# EasyEDA Pro project G07_太阳能景观灯_PCB终稿_2024-07-05.epro

# Schematic Schematic1
Create Date: 2024-07-01; Page Name: P1; Project Name: G07_太阳能景观灯; Schematic Name: Schematic1; Update Date: 2024-07-04; Company: ZJU; Page Size: A4; Version: V1.0
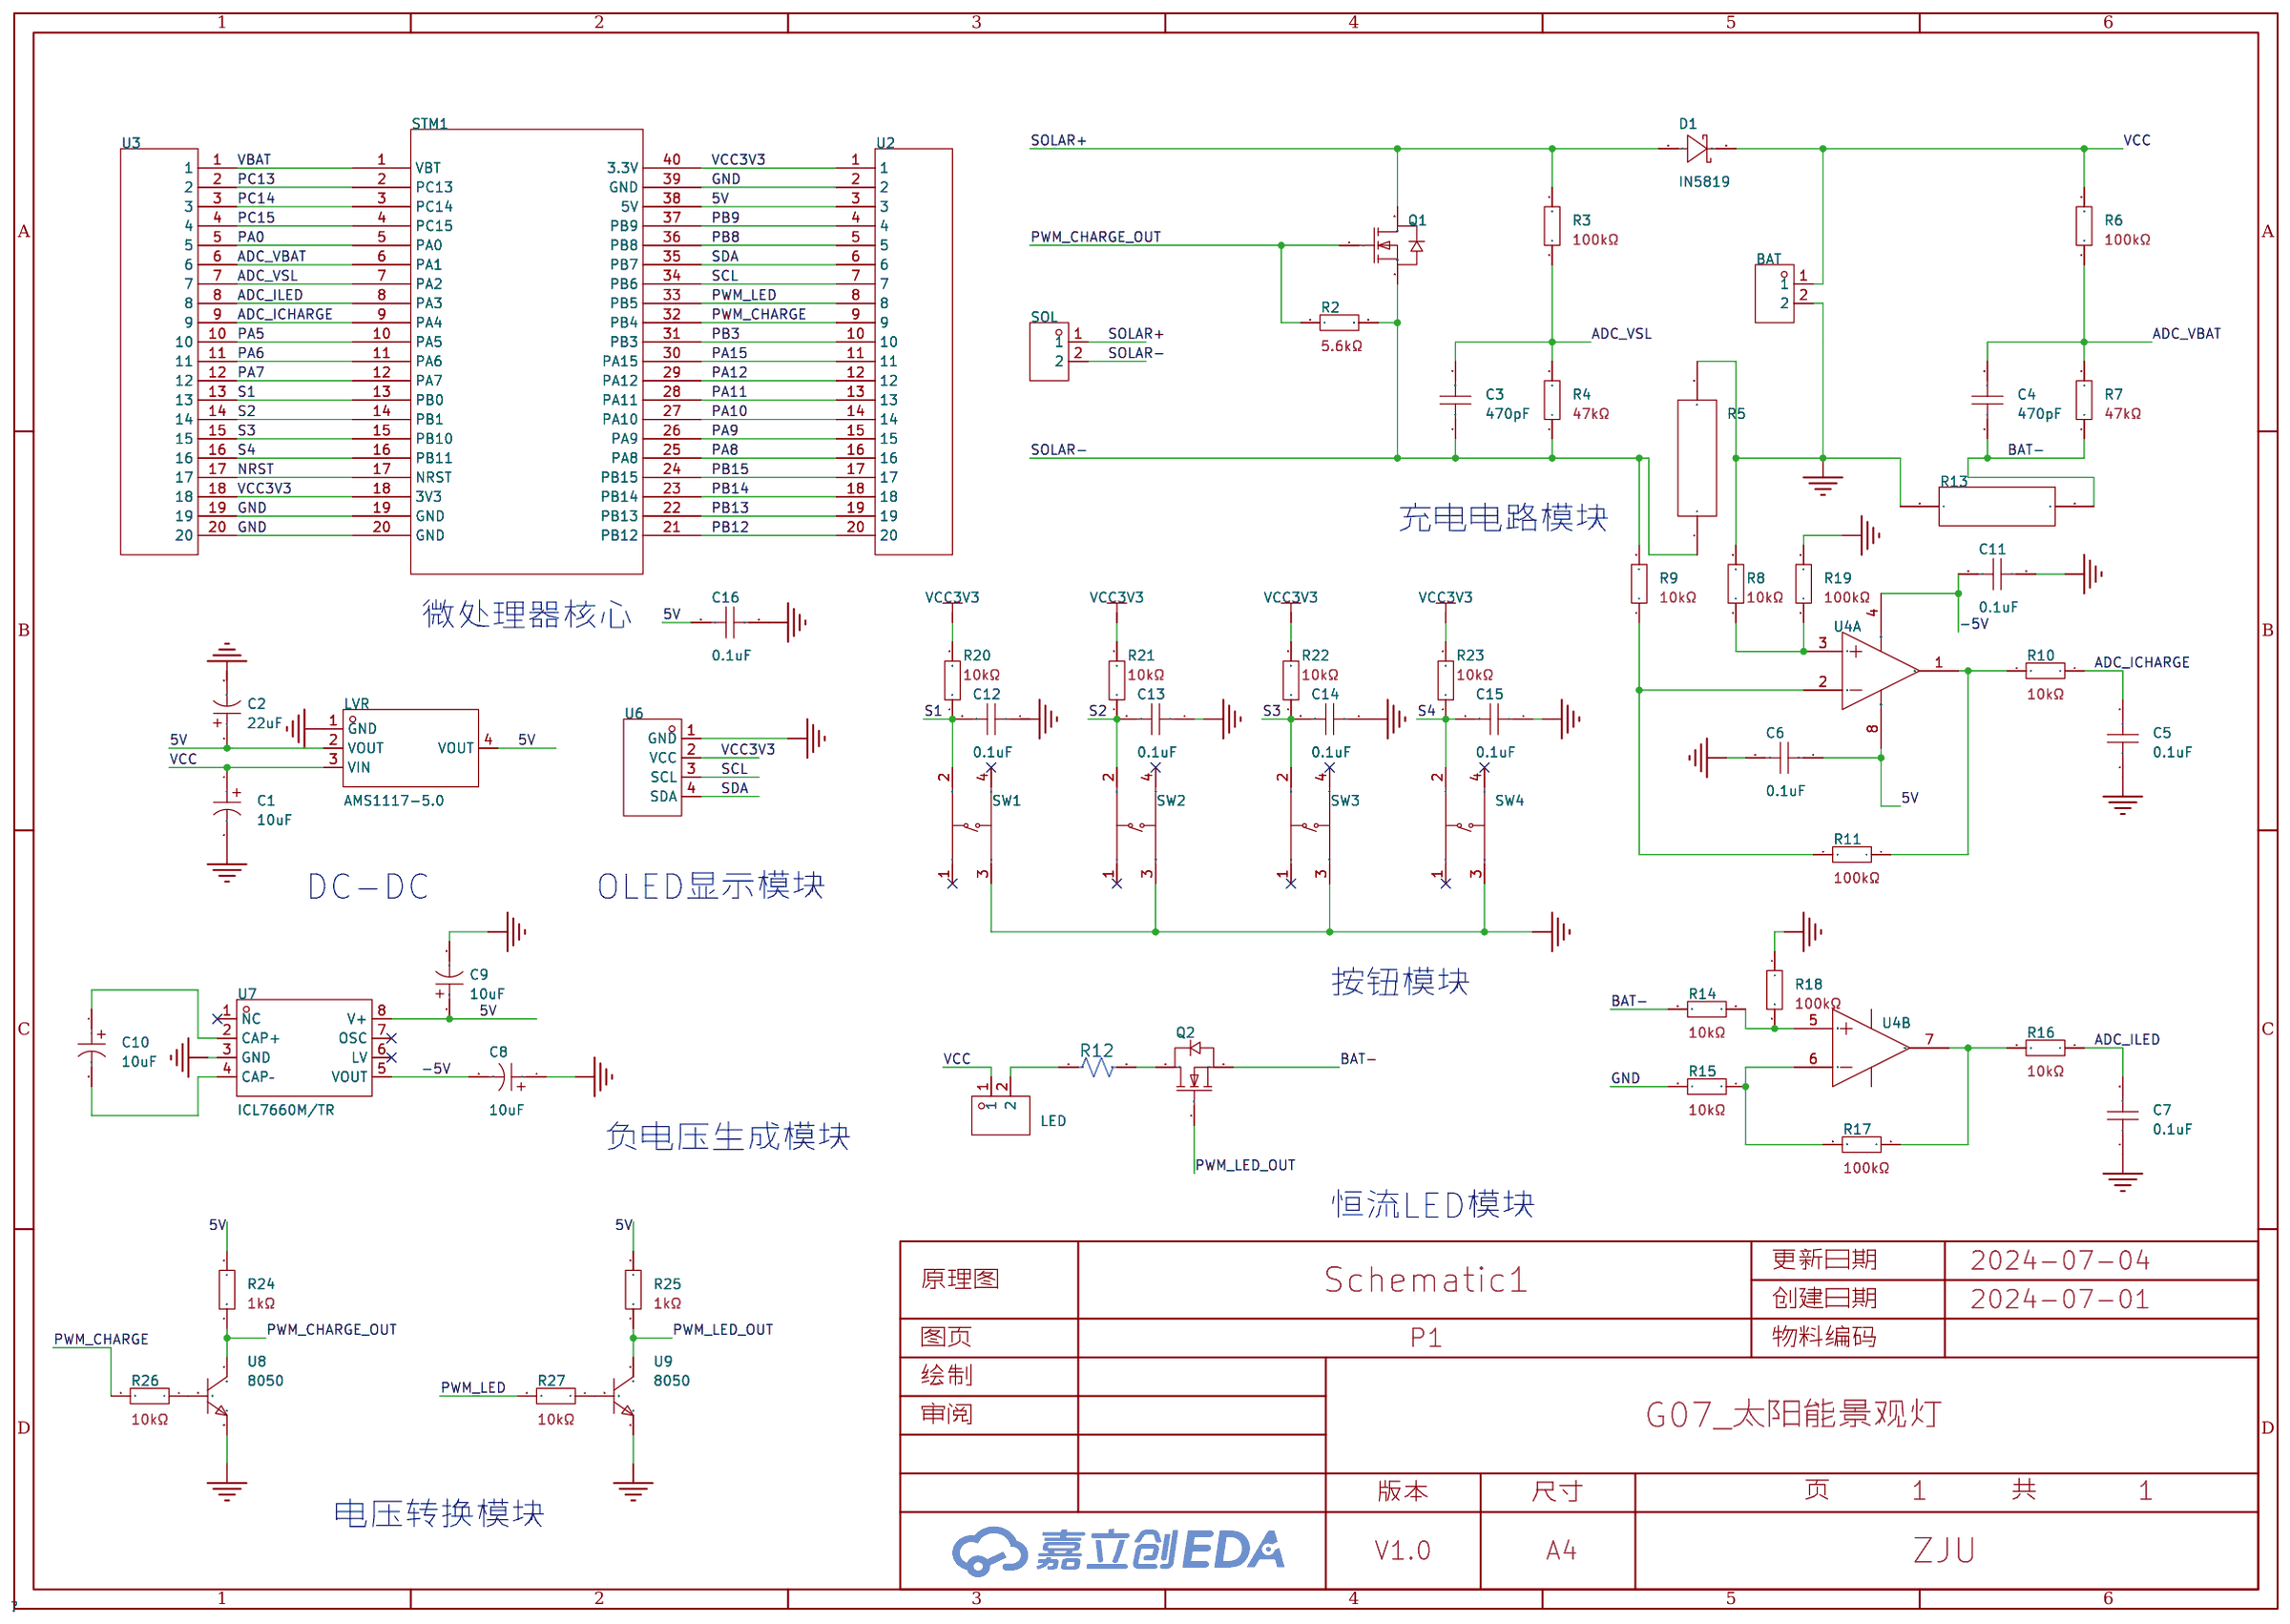
[diagram p0: schematic sheet]

## Parts
BAT  KF2EDGK-5.08-2P  [CONN-TH_2P-P5.08_DB2EVC-5.08-2P-BK]
C1  10uF  [C0511_直插电解]
C2  22uF  [C0511_直插电解]
C3  470pF  [CC1H104ZA1FD3F6C1000]
C4  470pF  [CC1H104ZA1FD3F6C1000]
C5  0.1uF  [CC1H104ZA1FD3F6C1000]
C6  0.1uF  [CC1H104ZA1FD3F6C1000]
C7  0.1uF  [CC1H104ZA1FD3F6C1000]
C8  10uF  [C0511_直插电解]
C9  10uF  [C0511_直插电解]
C10  10uF  [C0511_直插电解]
C11  0.1uF  [CC1H104ZA1FD3F6C1000]
C12  0.1uF  [CC1H104ZA1FD3F6C1000]
C13  0.1uF  [CC1H104ZA1FD3F6C1000]
C14  0.1uF  [CC1H104ZA1FD3F6C1000]
C15  0.1uF  [CC1H104ZA1FD3F6C1000]
C16  0.1uF  [CC1H104ZA1FD3F6C1000]
D1  IN5819  [DO-41_BD2.4-L4.7-P8.70-D0.8-FD]
LED  KF2EDGK-5.08-2P  [CONN-TH_2P-P5.08_DB2EVC-5.08-2P-BK]
LVR  AMS1117-5.0  [SOT-223_L6.5-W3.5-P2.30-LS7.0-BR]
Q1  STP75NF75  [TO-220-3_L10.0-W4.5-P2.54-L]
Q2  STP75NF75  [TO-220-3_L10.0-W4.5-P2.54-L]
R2  AXIAL-0.4  [RES-TH_BD2.7-L8.8-P12.80-D0.5]
R3  AXIAL-0.4  [RES-TH_BD2.7-L8.8-P12.80-D0.5]
R4  AXIAL-0.4  [RES-TH_BD2.7-L8.8-P12.80-D0.5]
R5  -  [采样电阻2*10mm]
R6  AXIAL-0.4  [RES-TH_BD2.7-L8.8-P12.80-D0.5]
R7  AXIAL-0.4  [RES-TH_BD2.7-L8.8-P12.80-D0.5]
R8  AXIAL-0.4  [RES-TH_BD2.7-L8.8-P12.80-D0.5]
R9  AXIAL-0.4  [RES-TH_BD2.7-L8.8-P12.80-D0.5]
R10  AXIAL-0.4  [RES-TH_BD2.7-L8.8-P12.80-D0.5]
R11  AXIAL-0.4  [RES-TH_BD2.7-L8.8-P12.80-D0.5]
R12  -  [AXIAL_0.6]
R13  -  [采样电阻2*10mm]
R14  AXIAL-0.4  [RES-TH_BD2.7-L8.8-P12.80-D0.5]
R15  AXIAL-0.4  [RES-TH_BD2.7-L8.8-P12.80-D0.5]
R16  AXIAL-0.4  [RES-TH_BD2.7-L8.8-P12.80-D0.5]
R17  AXIAL-0.4  [RES-TH_BD2.7-L8.8-P12.80-D0.5]
R18  AXIAL-0.4  [RES-TH_BD2.7-L8.8-P12.80-D0.5]
R19  AXIAL-0.4  [RES-TH_BD2.7-L8.8-P12.80-D0.5]
R20  AXIAL-0.4  [RES-TH_BD2.7-L8.8-P12.80-D0.5]
R21  AXIAL-0.4  [RES-TH_BD2.7-L8.8-P12.80-D0.5]
R22  AXIAL-0.4  [RES-TH_BD2.7-L8.8-P12.80-D0.5]
R23  AXIAL-0.4  [RES-TH_BD2.7-L8.8-P12.80-D0.5]
R24  AXIAL-0.4  [RES-TH_BD2.7-L8.8-P12.80-D0.5]
R25  AXIAL-0.4  [RES-TH_BD2.7-L8.8-P12.80-D0.5]
R26  AXIAL-0.4  [RES-TH_BD2.7-L8.8-P12.80-D0.5]
R27  AXIAL-0.4  [RES-TH_BD2.7-L8.8-P12.80-D0.5]
SOL  KF2EDGK-5.08-2P  [CONN-TH_2P-P5.08_DB2EVC-5.08-2P-BK]
STM1  STM32103C8T6  [STM32_C8T6_核心板]
SW1  TS665CJ  [SW-TH_4P-L6.0-W6.0-P4.50-LS6.5]
SW2  TS665CJ  [SW-TH_4P-L6.0-W6.0-P4.50-LS6.5]
SW3  TS665CJ  [SW-TH_4P-L6.0-W6.0-P4.50-LS6.5]
SW4  TS665CJ  [SW-TH_4P-L6.0-W6.0-P4.50-LS6.5]
U2  -  [XH2.54_20P]
U3  -  [XH2.54_20P]
U4  LM358S  [SOP-8_L4.9-W3.9-P1.27-LS6.0-BL]  (sections 1,2)
U6  HS96L03W2C03  [OLED-TH_L27.8-W27.2-P2.54_C9900033791]
U7  ICL7660M/TR  [SOP-8_L4.9-W3.9-P1.27-LS6.0-BL]
U8  8050  [TO-92-3_L4.8-W3.7-P2.54-R]
U9  8050  [TO-92-3_L4.8-W3.7-P2.54-R]

## Library data of the parts
BAT LED SOL = KF2EDGK-5.08-2P: Supplier Part: C9900089420; Supplier Footprint: CONN-TH_2P-P5.08_DB2EVC-5.08-2P; JLCPCB Part Class: 扩展库; Supplier: LCSC
C1 C2 C8-C10 = C0511_直插电解电容: C0511直插电解电容; Supplier Footprint: 直插,D5xL11mm; Rated Voltage: 35V; φD: 5mm; L: 11mm; Lead Spacing: 2mm
C3-C7 C11-C16 = CC1H104ZA1ED3F5O1100: 容值:100nF;精度:-20%~+80%;额定电压:50V;温度系数:Y5V;; LCSC Part Name: 100nF -20%~+80% 50V; Supplier Part: C2761728; Manufacturer: Dersonic(德尔创); Supplier Footprint: 插件,P=2.54mm; JLCPCB Part Class: 扩展库; Datasheet: https://atta.szlcsc.com/upload/public/pdf/source/20211025/1A7587EB9213FE403B9063878B9D301B.pdf; Supplier: LCSC; Tolerance: -20%~+80%; Voltage Rated: 50V; Lead Spacing: 2.54mm; Temperature Coefficient: Y5V; φD: 5.8mm; Body Thickness: 2.6mm
D1 = IN5819: Supplier Part: C9900005587; Supplier Footprint: DO-41; JLCPCB Part Class: 扩展库; Supplier: LCSC
LVR = AMS1117-5.0_C6187: 输出类型:固定;最大输入电压:12V;输出电压:5V;最大输出电流:1A;电源纹波抑制比(PSRR):68dB@(120Hz);输出极性:正极;; LCSC Part Name: 输入12V 输出5V 1A; Supplier Part: C6187; Manufacturer: AMS; Supplier Footprint: SOT-223; JLCPCB Part Class: 基础库; Datasheet: https://atta.szlcsc.com/upload/public/pdf/source/20230918/E4B716057EE82179D88E8A0894830D59.pdf; Supplier: LCSC; Output Type: 固定; Maximum Input Voltage: 12V; Output Voltage: 5V; MAX Output Current: 1A; Power Supply Rejection Ratio (PSRR): 68dB@(120Hz); Dropout Voltage: 1.3V@(1A); Output Polarity: 正极; Number of Outputs: 1
Q1 Q2 = STP75NF75: 类型:N沟道;漏源电压(Vdss):75V;连续漏极电流(Id):80A;功率(Pd):300W;导通电阻(RDS(on)@Vgs,Id):11mΩ@10V,40A;阈值电压(Vgs(th)@Id):4V@250uA;; LCSC Part Name: N沟道 耐压:75V 电流:80A; Supplier Part: C13678; Manufacturer: ST(意法半导体); Supplier Footprint: TO-220; JLCPCB Part Class: 扩展库; Datasheet: https://atta.szlcsc.com/upload/public/pdf/source/20130607/1457706608687.pdf; Supplier: LCSC; Type: N沟道; Drain Source Voltage (Vdss): 75V; Continuous Drain Current (Id): 80A; Power Dissipation (Pd): 300W; Drain Source On Resistance (RDS(on)@Vgs,Id): 11mΩ@10V,40A; Gate Threshold Voltage (Vgs(th)@Id): 4V@250uA; Total Gate Charge (Qg@Vgs): 160nC@10V; Input Capacitance (Ciss@Vds): 3.7nF@25V; Operating Temperature: -55℃~+175℃@(Tj)
R2 = AXIAL-0.4: Supplier Part: C9900024059; Supplier Footprint: AXIAL; JLCPCB Part Class: 扩展库; Supplier: LCSC; Resistance: 5.6kΩ
R3 R6 R11 R17-R19 = AXIAL-0.4: Supplier Part: C9900024059; Supplier Footprint: AXIAL; JLCPCB Part Class: 扩展库; Supplier: LCSC; Resistance: 100kΩ
R4 R7 = AXIAL-0.4: Supplier Part: C9900024059; Supplier Footprint: AXIAL; JLCPCB Part Class: 扩展库; Supplier: LCSC; Resistance: 47kΩ
R5 R13 = 采样电阻
R8-R10 R14-R16 R20-R23 R26 R27 = AXIAL-0.4: Supplier Part: C9900024059; Supplier Footprint: AXIAL; JLCPCB Part Class: 扩展库; Supplier: LCSC; Resistance: 10kΩ
R12 = AXIAL0.6
R24 R25 = AXIAL-0.4: Supplier Part: C9900024059; Supplier Footprint: AXIAL; JLCPCB Part Class: 扩展库; Supplier: LCSC; Resistance: 1kΩ
STM1 = stm32103c8t6_核心板: Origin Footprint 2: DIP40
SW1-SW4 = TS665CJ: 电路结构:单刀单掷;按钮形状:圆形按钮;安装方式:直插;开关长度:6mm;开关宽度:6mm;开关高度:5mm;触点电流:50mA;额定电压(DC):12V;带灯:-;机械寿命:-;; LCSC Part Name: 6*6*5mm 直插 轻触开关; Supplier Part: C393938; Manufacturer: SHOU HAN(首韩); Supplier Footprint: 插件; JLCPCB Part Class: 扩展库; Datasheet: https://atta.szlcsc.com/upload/public/pdf/source/20190521/C393938_BDABEAC600B4C55E200A80AA129B70BC.pdf; Supplier: LCSC; Circuit: 单刀单掷; Actuator Style: 圆形按钮; Mounting Style: 直插; Switch Length: 6mm; Switch Width: 6mm; Switch Height: 5mm; Contact Current: 50mA; Voltage Rating (DC): 12V
U2 U3 = XH2.54_20P
U4 = LM358S_C408270: 放大器数:-;增益带宽积(GBP):1MHz;压摆率(SR):0.3V/us;; Supplier Part: C408270; Manufacturer: Slkor(萨科微); Supplier Footprint: SOP-8; JLCPCB Part Class: 扩展库; Datasheet: https://atta.szlcsc.com/upload/public/pdf/source/20190729/C408270_8A571363543B0DAC89A7C1628AEF28C4.pdf; Supplier: LCSC; Gain Bandwidth Product(GBP): 1MHz; Common Mode Rejection Ratio (CMRR): 80dB; Slew Rate(SR): 0.3V/us
U6 = HS96L03W2C03: 主控芯片:SSD1315;接口类型:I2C;尺寸(inch):0.96;像素分辨率:128x64;; LCSC Part Name: 0.96寸OLED显示屏窄白光IIC; Supplier Part: C5248080; Manufacturer: HS(汉昇); JLCPCB Part Class: 扩展库; Datasheet: https://atta.szlcsc.com/upload/public/pdf/source/20230627/763D01F79A90007632F098068C7C8AD9.pdf; Supplier: LCSC; Main Control Chip: SSD1315; Interface Type: I2C; Size: 0.96; Pixel Resolution: 128x64; Operating Temperature: -40℃~+70℃
U7 = ICL7660M/TR: Supplier Part: C356724; Manufacturer: HGSEMI(华冠); Supplier Footprint: SOP-8; JLCPCB Part Class: 扩展库; Datasheet: https://atta.szlcsc.com/upload/public/pdf/source/20220223/B7DC69E53F1DD57A8AF8717E7604F527.pdf; Supplier: LCSC
U8 U9 = 8050: Supplier Part: C3037602; Manufacturer: BLUE ROCKET(蓝箭); Supplier Footprint: TO-92-2.54mm; JLCPCB Part Class: 扩展库; Supplier: LCSC

## Nets
5V: C2.1 C6.1 C9.1 C16.2 LVR.2(VOUT) LVR.4(VOUT) R24.2 R25.2 STM1.38(5V) U2.3 U4.8(VCC) U7.8(V+)
-5V: C8.2 C11.2 U4.4(GND) U7.5(VOUT)
GND: BAT.2 C1.2 C2.2 C5.1 C6.2 C7.1 C8.1 C9.2 C11.1 C12.1 C13.1 C14.1 C15.1 C16.1 LVR.1(GND) R5.2 R8.2 R13.1 R15.2 R18.1 R19.2 STM1.19(GND) STM1.20(GND) STM1.39(GND) SW1.3(C) SW2.3(C) SW3.3(C) SW4.3(C) U2.2 U3.19 U3.20 U6.1(GND) U7.3(GND) U8.3(E) U9.3(E)
VBAT: STM1.1(VBT) U3.1
VCC: BAT.1 C1.1 D1.2(K) LED.1 LVR.3(VIN) R6.2
VCC3V3: R20.2 R21.2 R22.2 R23.2 STM1.18(3V3) STM1.40(3.3V) U2.1 U3.18 U6.2(VCC)
ADC_ICHARGE: C5.2 R10.1 STM1.9(PA4) U3.9
ADC_ILED: C7.2 R16.1 STM1.8(PA3) U3.8
ADC_VBAT: C4.2 R6.1 R7.2 STM1.6(PA1) U3.6
ADC_VSL: C3.2 R3.1 R4.2 STM1.7(PA2) U3.7
BAT-: C4.1 Q2.3(S) R7.1 R13.2 R14.2
NRST: STM1.17(NRST) U3.17
PA0: STM1.5(PA0) U3.5
PA5: STM1.10(PA5) U3.10
PA6: STM1.11(PA6) U3.11
PA7: STM1.12(PA7) U3.12
PA8: STM1.25(PA8) U2.16
PA9: STM1.26(PA9) U2.15
PA10: STM1.27(PA10) U2.14
PA11: STM1.28(PA11) U2.13
PA12: STM1.29(PA12) U2.12
PA15: STM1.30(PA15) U2.11
PB3: STM1.31(PB3) U2.10
PB8: STM1.36(PB8) U2.5
PB9: STM1.37(PB9) U2.4
PB12: STM1.21(PB12) U2.20
PB13: STM1.22(PB13) U2.19
PB14: STM1.23(PB14) U2.18
PB15: STM1.24(PB15) U2.17
PC13: STM1.2(PC13) U3.2
PC14: STM1.3(PC14) U3.3
PC15: STM1.4(PC15) U3.4
PWM_CHARGE: R26.2 STM1.32(PB4) U2.9
PWM_CHARGE_OUT: Q1.1(G) R2.1 R24.1 U8.1(C)
PWM_LED: R27.2 STM1.33(PB5) U2.8
PWM_LED_OUT: Q2.1(G) R25.1 U9.1(C)
S1: C12.2 R20.1 STM1.13(PB0) SW1.2(B) U3.13
S2: C13.2 R21.1 STM1.14(PB1) SW2.2(B) U3.14
S3: C14.2 R22.1 STM1.15(PB10) SW3.2(B) U3.15
S4: C15.2 R23.1 STM1.16(PB11) SW4.2(B) U3.16
SCL: STM1.34(PB6) U2.7 U6.3(SCL)
SDA: STM1.35(PB7) U2.6 U6.4(SDA)
SOLAR+: D1.1(A) Q1.2(D) R3.2 SOL.1
SOLAR-: C3.1 Q1.3(S) R2.2 R4.1 R5.1 R9.2 SOL.2
$1N3294: R10.2 R11.1 U4.1(OUT1)
$1N3303: R9.1 R11.2 U4.2(IN1-)
$1N14439: R14.1 R18.2 U4.5(IN2+)
$1N14610: R16.2 R17.1 U4.7(OUT2)
$1N14619: R15.1 R17.2 U4.6(IN2-)
$1N14806: R8.1 R19.1 U4.3(IN1+)
$1N19814: C10.2 U7.4(CAP–)
$1N19908: C10.1 U7.2(CAP+)
$1N30770: LED.2 R12.1
$1N30774: Q2.2(D) R12.2
$1N32429: R26.1 U8.2(B)
$1N32462: R27.1 U9.2(B)

Not connected (* = marked no-connect by the designer): SW1 1(A)* 4(D)*; SW2 1(A)* 4(D)*; SW3 1(A)* 4(D)*; SW4 1(A)* 4(D)*; U7 1(NC)* 6(LV)* 7(OSC)*

## Notes on the sheet
- 充电电路模块
- 微处理器核心
- DC-DC
- OLED显示模块
- 按钮模块
- 负电压生成模块
- 恒流LED模块
- 电压转换模块

# Board PCB1
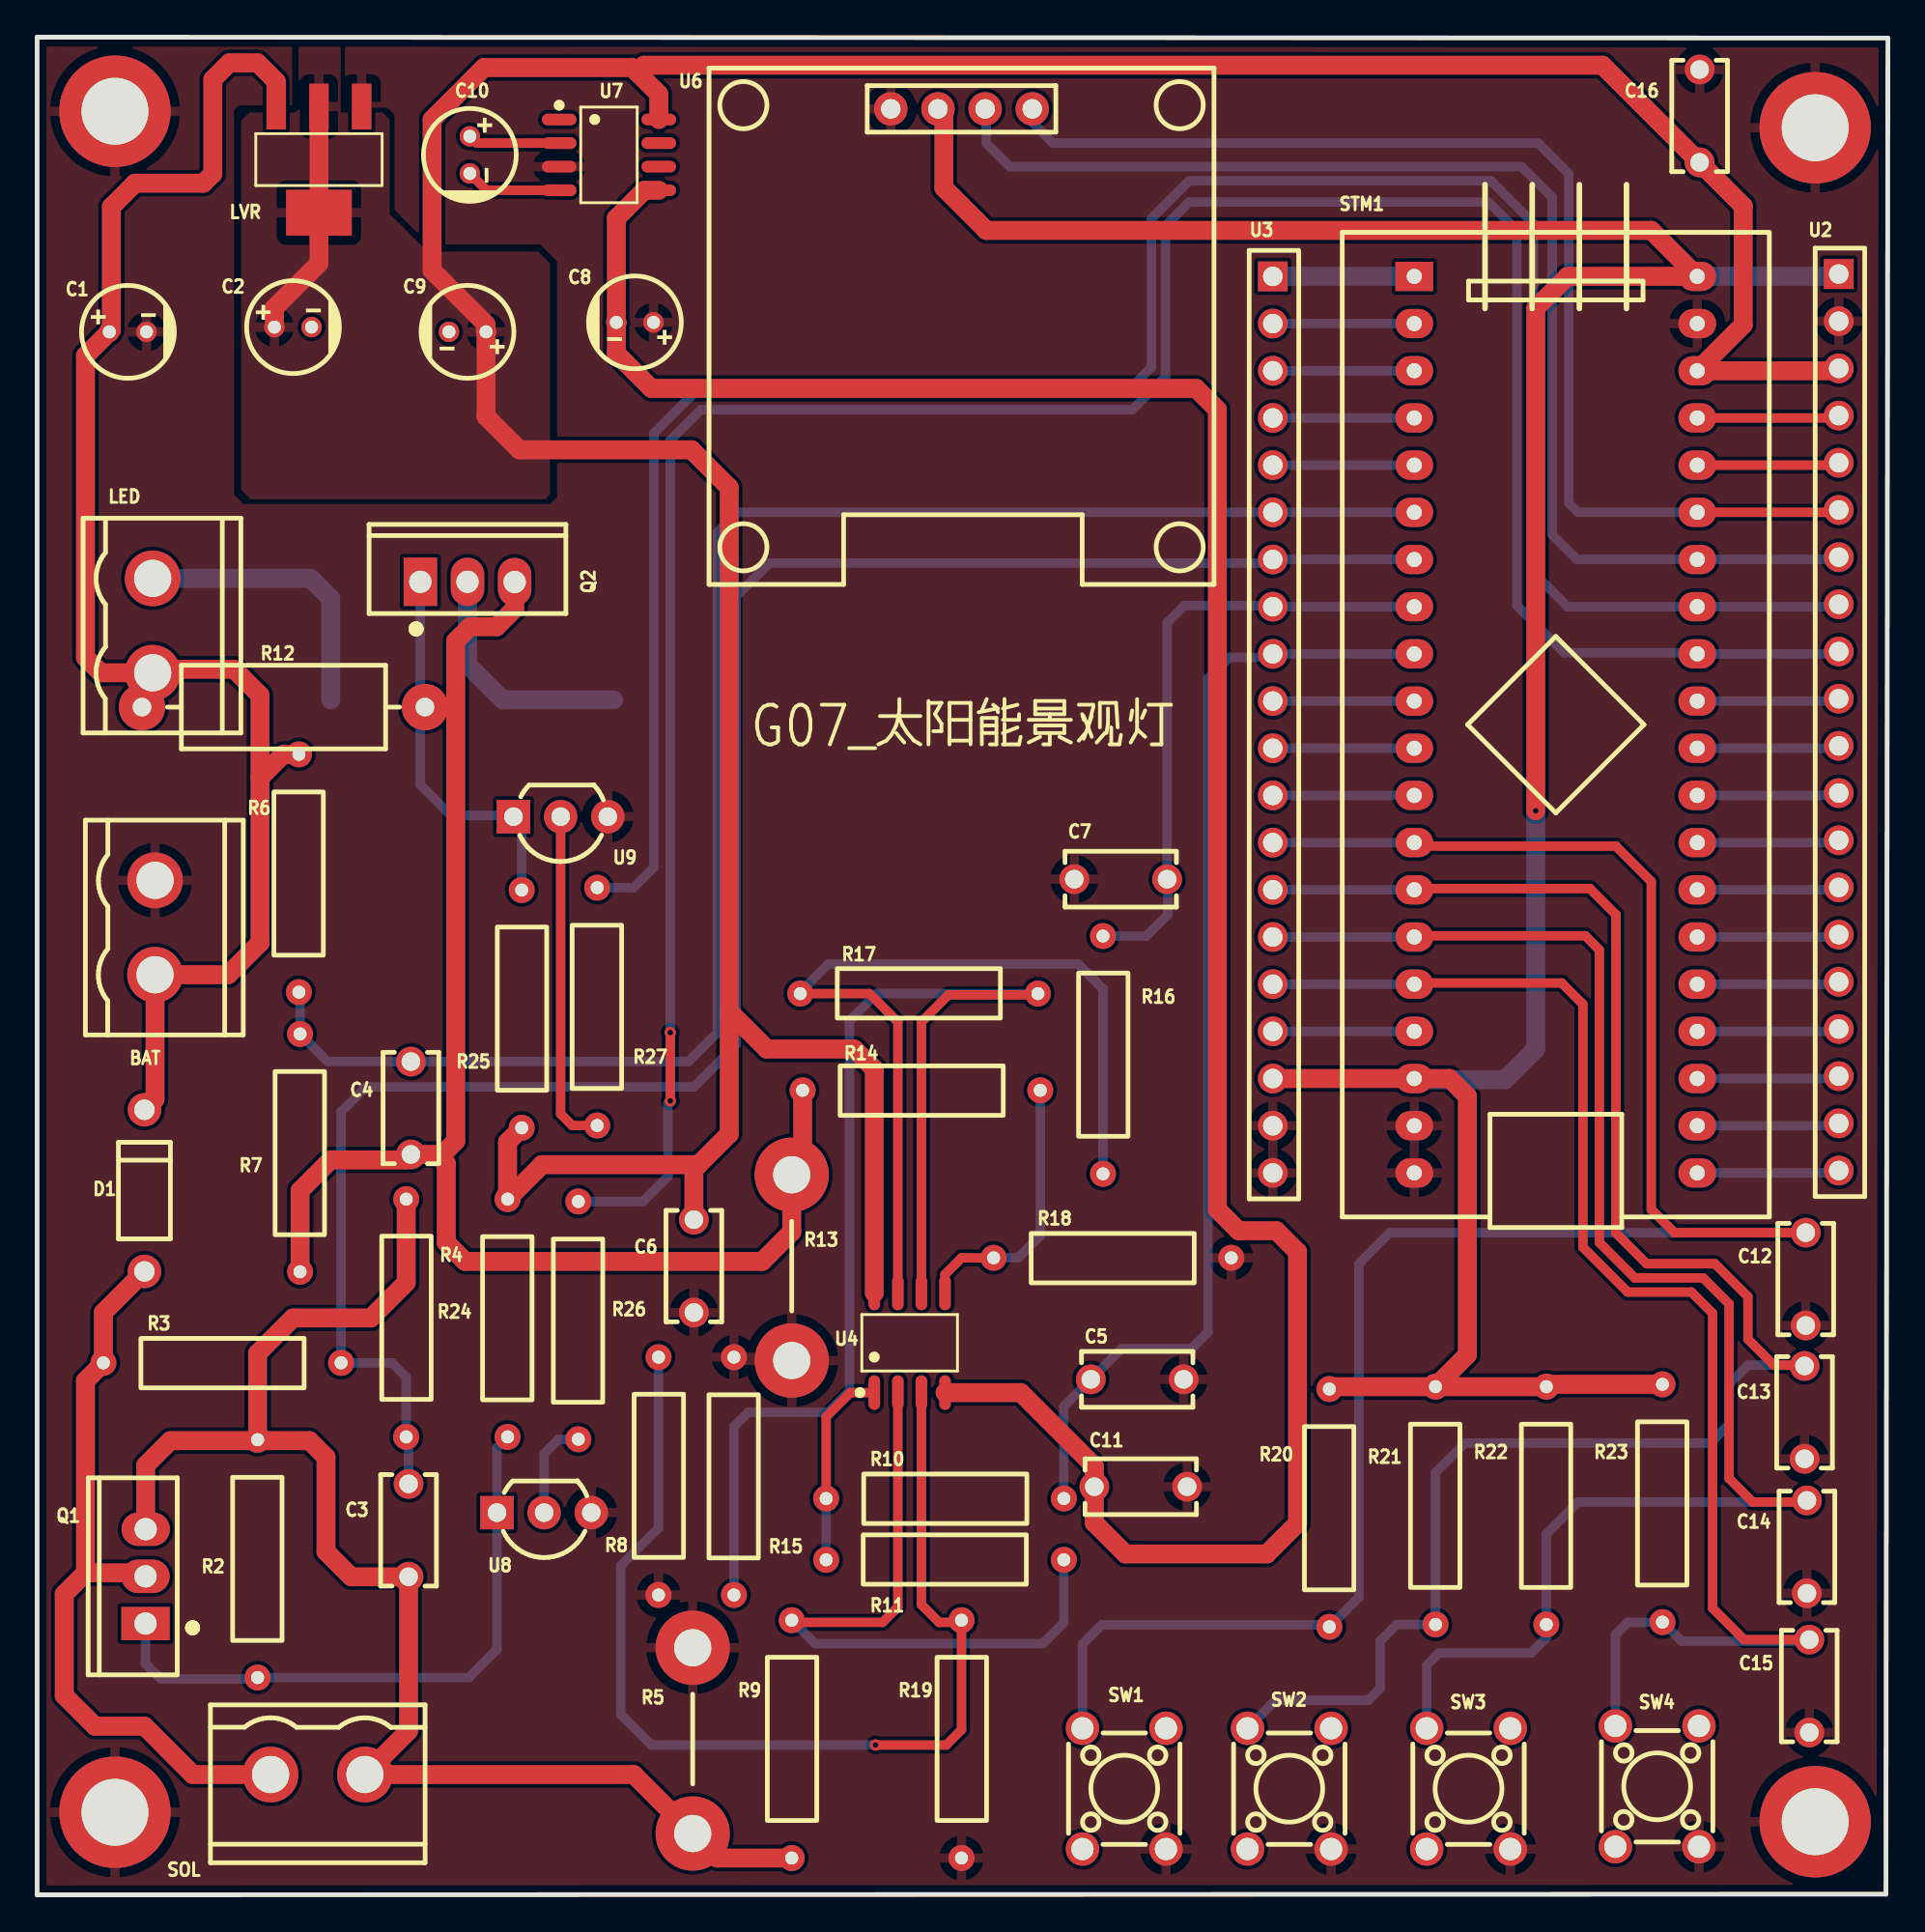
[diagram p1: board, top side]
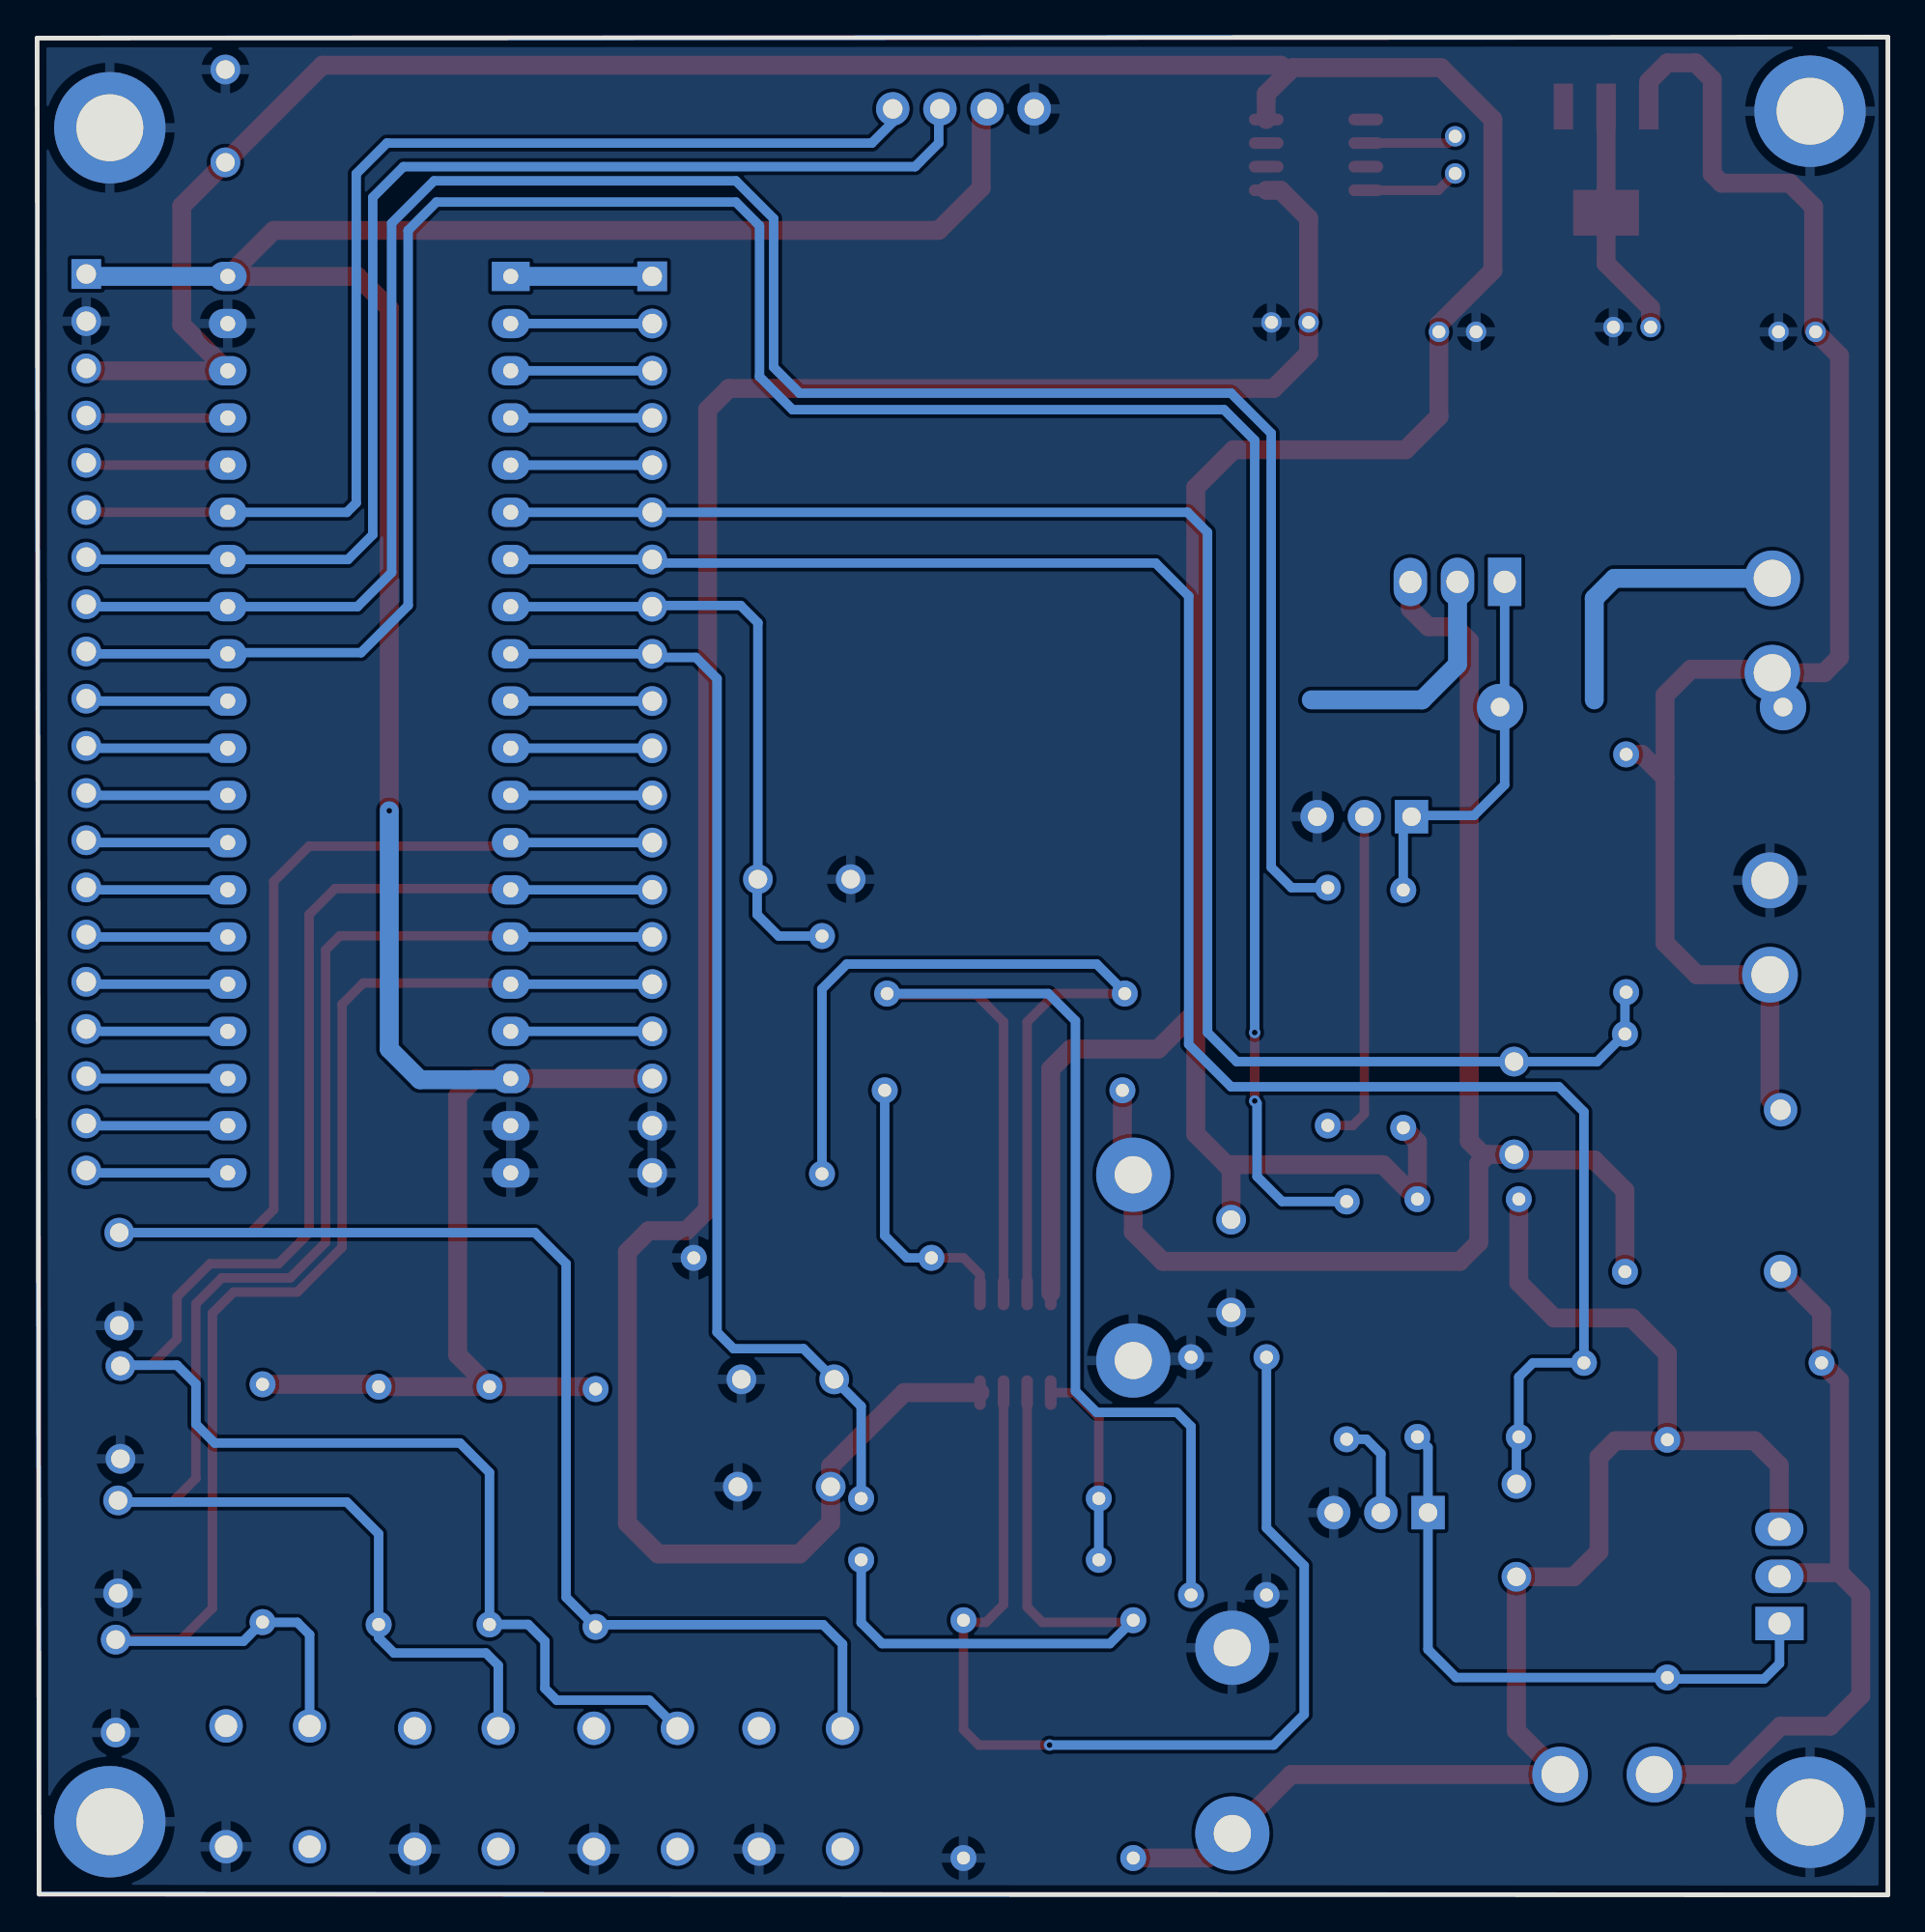
[diagram p2: board, bottom side, seen from below]

Outline 99.67 x 100 mm; copper layers: Top Layer, Bottom Layer. Coordinates in mm from the lower left corner of the outline.
Outline path: 0,0 0,100 99.67,99.95 99.57,0.04 0,0
Stack: Top Layer 0.035mm / Dielectric1 1.51mm FR4 er 4.5 / Bottom Layer 0.035mm

## Design rules (mm)
template: JLCPCB Capability(Two Layers Board)
spacing copperThickness1oz (default): track to track 0.102, other pairs 0.152 to 0.3
spacing copperThickness2oz: track to track 0.203, other pairs 0.152 to 0.3
track width copperThickness1oz (default): min 0.127, default 0.254, max 2.54
track width copperThickness2oz: min 0.203, default 0.254, max 2.54
differential pair differentialPair (default): width min 0.127, default 0.254, max 2.54; gap min 0.152, default 0.152
via viaSize (default): diameter min 0.5, default 0.61, max 10; hole min 0.3, default 0.305, max 6.3

## Placement (name value [footprint] x y rotation side)
BAT  KF2EDGK-5.08-2P  [CONN-TH_2P-P5.08_DB2EVC-5.08-2P-BK]  6.35 52.07 90 top
C1  10uF  [C0511_直插电解]  4.89 84.14 0 top
C2  22uF  [C0511_直插电解]  13.78 84.39 0 top
C3  470pF  [CC1H104ZA1FD3F6C1000]  20 19.62 90 top
C4  470pF  [CC1H104ZA1FD3F6C1000]  20.13 42.35 90 top
C5  0.1uF  [CC1H104ZA1FD3F6C1000]  59.25 27.75 180 top
C6  0.1uF  [CC1H104ZA1FD3F6C1000]  35.37 33.85 270 top
C7  0.1uF  [CC1H104ZA1FD3F6C1000]  58.36 54.67 0 top
C8  10uF  [C0511_直插电解]  32.19 84.65 180 top
C9  10uF  [C0511_直插电解]  23.18 84.14 180 top
C10  10uF  [C0511_直插电解]  23.3 93.66 270 top
C11  0.1uF  [CC1H104ZA1FD3F6C1000]  59.44 21.97 180 top
C12  0.1uF  [CC1H104ZA1FD3F6C1000]  95.25 33.15 90 top
C13  0.1uF  [CC1H104ZA1FD3F6C1000]  95.19 25.97 90 top
C14  0.1uF  [CC1H104ZA1FD3F6C1000]  95.31 18.73 90 top
C15  0.1uF  [CC1H104ZA1FD3F6C1000]  95.44 11.24 90 top
C16  0.1uF  [CC1H104ZA1FD3F6C1000]  89.53 95.76 270 top
D1  IN5819  [DO-41_BD2.4-L4.7-P8.70-D0.8-FD]  5.78 37.91 90 top
LED  KF2EDGK-5.08-2P  [CONN-TH_2P-P5.08_DB2EVC-5.08-2P-BK]  6.22 68.33 90 top
LVR  AMS1117-5.0  [SOT-223_L6.5-W3.5-P2.30-LS7.0-BR]  15.18 93.41 90 top
NOREF  -  [Pad_e70]  95.76 3.94 90 top
NOREF#2  -  [Pad_e73]  4.19 96.01 90 top
NOREF#3  -  [Pad_e72]  4.19 4.45 90 top
NOREF#4  -  [Pad_e71]  95.76 95.12 90 top
Q1  STP75NF75  [TO-220-3_L10.0-W4.5-P2.54-L]  5.84 17.15 90 top
Q2  STP75NF75  [TO-220-3_L10.0-W4.5-P2.54-L]  23.18 70.68 0 top
R2  AXIAL-0.4  [RES-TH_BD2.7-L8.8-P12.80-D0.5]  11.87 18.1 90 top
R3  AXIAL-0.4  [RES-TH_BD2.7-L8.8-P12.80-D0.5]  9.97 28.64 180 top
R4  AXIAL-0.4  [RES-TH_BD2.7-L8.8-P12.80-D0.5]  19.88 31.05 270 top
R5  -  [采样电阻2*10mm]  35.31 3.3 90 top
R6  AXIAL-0.4  [RES-TH_BD2.7-L8.8-P12.80-D0.5]  14.1 54.99 90 top
R7  AXIAL-0.4  [RES-TH_BD2.7-L8.8-P12.80-D0.5]  14.16 39.94 90 top
R8  AXIAL-0.4  [RES-TH_BD2.7-L8.8-P12.80-D0.5]  33.46 22.54 270 top
R9  AXIAL-0.4  [RES-TH_BD2.7-L8.8-P12.80-D0.5]  40.64 8.38 270 top
R10  AXIAL-0.4  [RES-TH_BD2.7-L8.8-P12.80-D0.5]  48.9 21.34 180 top
R11  AXIAL-0.4  [RES-TH_BD2.7-L8.8-P12.80-D0.5]  48.9 18.03 0 top
R12  -  [AXIAL_0.6]  15.81 64.33 0 top
R13  -  [采样电阻2*10mm]  40.64 28.76 90 top
R14  AXIAL-0.4  [RES-TH_BD2.7-L8.8-P12.80-D0.5]  47.62 43.31 180 top
R15  AXIAL-0.4  [RES-TH_BD2.7-L8.8-P12.80-D0.5]  37.53 22.54 90 top
R16  AXIAL-0.4  [RES-TH_BD2.7-L8.8-P12.80-D0.5]  57.4 45.21 270 top
R17  AXIAL-0.4  [RES-TH_BD2.7-L8.8-P12.80-D0.5]  47.5 48.51 0 top
R18  AXIAL-0.4  [RES-TH_BD2.7-L8.8-P12.80-D0.5]  57.91 34.29 180 top
R19  AXIAL-0.4  [RES-TH_BD2.7-L8.8-P12.80-D0.5]  49.78 8.38 270 top
R20  AXIAL-0.4  [RES-TH_BD2.7-L8.8-P12.80-D0.5]  69.6 20.83 90 top
R21  AXIAL-0.4  [RES-TH_BD2.7-L8.8-P12.80-D0.5]  75.31 20.96 90 top
R22  AXIAL-0.4  [RES-TH_BD2.7-L8.8-P12.80-D0.5]  81.28 20.96 90 top
R23  AXIAL-0.4  [RES-TH_BD2.7-L8.8-P12.80-D0.5]  87.53 21.08 90 top
R24  AXIAL-0.4  [RES-TH_BD2.7-L8.8-P12.80-D0.5]  25.34 31.05 90 top
R25  AXIAL-0.4  [RES-TH_BD2.7-L8.8-P12.80-D0.5]  26.1 47.69 270 top
R26  AXIAL-0.4  [RES-TH_BD2.7-L8.8-P12.80-D0.5]  29.15 30.92 90 top
R27  AXIAL-0.4  [RES-TH_BD2.7-L8.8-P12.80-D0.5]  30.16 47.82 90 top
SOL  KF2EDGK-5.08-2P  [CONN-TH_2P-P5.08_DB2EVC-5.08-2P-BK]  15.11 6.48 0 top
STM1  STM32103C8T6  [STM32_C8T6_核心板]  81.79 62.99 0 top
SW1  TS665CJ  [SW-TH_4P-L6.0-W6.0-P4.50-LS6.5]  58.55 5.72 90 top
SW2  TS665CJ  [SW-TH_4P-L6.0-W6.0-P4.50-LS6.5]  67.44 5.72 90 top
SW3  TS665CJ  [SW-TH_4P-L6.0-W6.0-P4.50-LS6.5]  77.09 5.72 90 top
SW4  TS665CJ  [SW-TH_4P-L6.0-W6.0-P4.50-LS6.5]  87.25 5.84 90 top
U2  -  [XH2.54_20P]  96.9 -25.91 270 top
U3  -  [XH2.54_20P]  66.42 -26.03 270 top
U4  LM358S  [SOP-8_L4.9-W3.9-P1.27-LS6.0-BL]  46.99 29.72 0 top
U6  HS96L03W2C03  [OLED-TH_L27.8-W27.2-P2.54_C9900033791]  49.78 96.14 0 top
U7  ICL7660M/TR  [SOP-8_L4.9-W3.9-P1.27-LS6.0-BL]  30.8 93.66 270 top
U8  8050  [TO-92-3_L4.8-W3.7-P2.54-R]  27.31 20.57 180 top
U9  8050  [TO-92-3_L4.8-W3.7-P2.54-R]  28.19 58.04 180 top

## Footprints (pads in the part's own frame, mm; a bottom-side part is the same pattern mirrored in y, then rotated)
AXIAL_0.6
  round 2.499 hole 1.001: 1(-10.165,-0.389) 2(5.075,-0.389)
C0511_直插电解
  round 1.1 hole 0.7: 1(-1,0) 2(1,0)
CC1H104ZA1FD3F6C1000
  round 1.6 hole 1.001: 1(-2.499,0) 2(2.499,0)
CONN-TH_2P-P5.08_DB2EVC-5.08-2P-BK
  round 3 hole 2: 1(-2.54,0) 2(2.54,0)
DO-41_BD2.4-L4.7-P8.70-D0.8-FD
  round 1.8 hole 1.1: 1(-4.35,0) 2(4.35,0)
OLED-TH_L27.8-W27.2-P2.54_C9900033791
  round 1.8 hole 1.05: 1(-3.81,0) 2(-1.27,0) 3(1.27,0) 4(3.81,0)
Pad_e70
  round 6 hole 3.6: 41(0,0)
Pad_e71
  round 6 hole 3.6: 41(0,0)
Pad_e72
  round 6 hole 3.6: 41(0,0)
Pad_e73
  round 6 hole 3.6: 41(0,0)
RES-TH_BD2.7-L8.8-P12.80-D0.5
  round 1.4 hole 0.7: 1(-6.4,0) 2(6.4,0)
SOP-8_L4.9-W3.9-P1.27-LS6.0-BL
  oval 0.63x1.865 smd: 1(-1.905,-2.683) 2(-0.635,-2.683) 3(0.635,-2.683) 4(1.905,-2.683) 5(1.905,2.683) 6(0.635,2.683) 7(-0.635,2.683) 8(-1.905,2.683)
SOT-223_L6.5-W3.5-P2.30-LS7.0-BR
  rect 2.465x1.05 smd: 1(2.857,-2.3) 2(2.857,0) 3(2.857,2.3)
  rect 2.465x3.54 smd: 4(-2.857,0)
STM32_C8T6_核心板
  rect 2.032x1.575 hole 0.813: 1(-7.62,24.13)
  oval 2.032x1.575 hole 0.813: 2(-7.62,21.59) 3(-7.62,19.05) 4(-7.62,16.51) 5(-7.62,13.97) 6(-7.62,11.43) 7(-7.62,8.89) 8(-7.62,6.35) 9(-7.62,3.81) 10(-7.62,1.27) 11(-7.62,-1.27) 12(-7.62,-3.81) 13(-7.62,-6.35) 14(-7.62,-8.89) 15(-7.62,-11.43) 16(-7.62,-13.97) 17(-7.62,-16.51) 18(-7.62,-19.05) 19(-7.62,-21.59) 20(-7.62,-24.13) 21(7.62,-24.13) 22(7.62,-21.59) 23(7.62,-19.05) 24(7.62,-16.51) 25(7.62,-13.97) 26(7.62,-11.43) 27(7.62,-8.89) 28(7.62,-6.35) 29(7.62,-3.81) 30(7.62,-1.27) 31(7.62,1.27) 32(7.62,3.81) 33(7.62,6.35) 34(7.62,8.89) 35(7.62,11.43) 36(7.62,13.97) 37(7.62,16.51) 38(7.62,19.05) 39(7.62,21.59) 40(7.62,24.13)
SW-TH_4P-L6.0-W6.0-P4.50-LS6.5
  round 1.8 hole 1.2: 1(-3.25,2.25) 2(3.25,2.25) 3(-3.25,-2.25) 4(3.25,-2.25)
TO-92-3_L4.8-W3.7-P2.54-R
  rect 1.8x1.8 hole 1: 1(2.54,0)
  round 1.8 hole 1: 2(0,0) 3(-2.54,0)
TO-220-3_L10.0-W4.5-P2.54-L
  rect 1.8x2.6 hole 1.2: 1(-2.54,0.005)
  oval 1.8x2.6 hole 1.2: 2(0,0.005) 3(2.54,-0.005)
XH2.54_20P
  rect 1.6x1.6 hole 1.05: 1(-113.157,0.127)
  round 1.6 hole 1.05: 2(-110.617,0.127) 3(-108.077,0.127) 4(-105.537,0.127) 5(-102.997,0.127) 6(-100.457,0.127) 7(-97.917,0.127) 8(-95.377,0.127) 9(-92.837,0.127) 10(-90.297,0.127) 11(-87.757,0.127) 12(-85.217,0.127) 13(-82.677,0.127) 14(-80.137,0.127) 15(-77.597,0.127) 16(-75.057,0.127) 17(-72.517,0.127) 18(-69.977,0.127) 19(-67.437,0.127) 20(-64.897,0.127)
采样电阻2*10mm
  round 4 hole 2: 1(0,0) 2(10,0)

## Nets
As in the schematic, except:
GND: BAT.2 C1.2 C2.2 C5.1 C6.2 C7.1 C8.1 C9.2 C11.1 C12.1 C13.1 C14.1 C15.1 C16.1 LVR.1 NOREF.41 NOREF#2.41 NOREF#3.41 NOREF#4.41 R5.2 R8.2 R13.1 R15.2 R18.1 R19.2 STM1.19 STM1.20 STM1.39 SW1.3 SW2.3 SW3.3 SW4.3 U2.2 U3.19 U3.20 U6.1 U7.3 U8.3 U9.3

Pads without a net: SW1 1 4; SW2 1 4; SW3 1 4; SW4 1 4; U7 1 6 7

## Via types
v1: diameter 0.61, hole 0.305, Top Layer to Bottom Layer, 4 vias

## Routing (per net, layer and track width the routed paths; a pad name or vN(x,y) marks a point on that pad's centre or on a via; arc(x,y) is an arc through that point)
5V: length 217.1
  Top Layer w1.016: 35.62,39.31 37.27,40.96 37.27,47.55 ; 35.62,39.31 35.37,39.05 C6.1 ; 35.62,39.31 27.19,39.31 R24.2 25.34,40.53 R25.2 ; U2.3 96.9,82.04 STM1.38 91.88,84.52 91.88,90.91 C16.2 84.31,98.49 32.69,98.49 32.31,98.11 ; C2.1 12.78,85.42 15.18,87.82 LVR.4 LVR.2 ; U7.8 33.48,96.94 32.31,98.11 ; 37.27,47.55 39.29,45.53 44.01,45.53 45.09,44.45 45.09,32.4 ; 37.27,47.55 37.27,75.76 35.24,77.79 25.97,77.79 24.18,79.58 C9.1 24.18,84.53 21.27,87.44 21.27,95.57 24.07,98.36 32.06,98.36 32.31,98.11
-5V: length 131.8
  Top Layer w1.016: U4.4 52.97,27.04 56.94,23.07 C11.2 56.94,20.03 58.61,18.35 66.23,18.35 67.88,20 67.88,34.61 66.74,35.75 64.71,35.75 63.56,36.89 63.56,79.95 62.42,81.09 33.08,81.09 31.19,82.98 C8.2 31.19,90.25 32.7,91.76 U7.5
VBAT: length 7.6
  Bottom Layer w1.016: U3.1 STM1.1
VCC: length 81.9
  Top Layer w1.016: 12,60.13 13.26,61.39 R6.2 ; 12,60.13 12,51.24 10.29,49.53 BAT.1 6.35,42.83 D1.2 ; 12,60.13 12,64.58 10.6,65.98 6.41,65.98 LED.1 3.43,65.79 2.6,66.61 2.6,82.85 C1.1 4,84.25 4,90.87 5.27,92.14 8.95,92.14 9.46,92.65 9.46,97.73 10.35,98.62 11.87,98.62 12.88,97.61 LVR.3
VCC3V3: length 156.4
  Top Layer w1.016: v1(80.71,58.36) 80.71,85.41 82.42,87.12 STM1.40 86.93,89.6 51.12,89.6 48.83,91.88 48.83,95.82 U6.2 ; R21.2 R22.2 81.41,27.48 R23.2 ; R21.2 69.72,27.36 R20.2 ; R21.2 77.03,29.07 77.03,42.99 76.07,43.94 STM1.18 U3.18
  Bottom Layer w1.016: STM1.18 74.23,43.88 79.06,43.88 80.71,45.53 v1(80.71,58.36) ; STM1.40 96.9,87.12 U2.1
ADC_ICHARGE: length 61.2
  Bottom Layer w0.508: R10.1 55.29,26.3 C5.2 58.4,29.4 62.17,29.4 63.06,30.29 63.06,65.47 64.2,66.61 66.36,66.61 U3.9 STM1.9
ADC_ILED: length 33.4
  Bottom Layer w0.508: R16.1 59.74,51.61 60.9,52.77 60.9,54.63 C7.2 60.86,68.48 61.79,69.41 66.48,69.41 U3.8 STM1.8
ADC_VBAT: length 90.9
  Bottom Layer w0.508: R6.1 14.16,48.53 R7.2 15.65,44.85 C4.2 35.07,44.85 36.64,46.42 36.64,73.34 37.72,74.42 U3.6 STM1.6
ADC_VSL: length 107.4
  Bottom Layer w0.508: STM1.7 U3.7 66.36,71.69 39.43,71.69 37.66,69.91 37.66,45.78 35.37,43.5 17.72,43.5 16.37,42.15 R3.1 19.11,28.64 19.88,27.88 R4.2 20,24.52 C3.2
BAT-: length 78.6
  Top Layer w1.016: R7.1 14.16,37.91 15.81,39.56 19.84,39.56 C4.1 21.54,39.86 ; 21.54,39.86 22.03,39.36 22.03,35.12 23.05,34.1 39.05,34.1 40.64,35.69 R13.2 41.22,39.35 R14.2 ; 21.54,39.86 21.82,39.86 22.54,40.58 22.54,67.5 23.31,68.26 24.75,68.26 25.72,69.23 Q2.3
NRST: length 7.6
  Bottom Layer w0.508: U3.17 STM1.17
PA0: length 7.6
  Bottom Layer w0.508: U3.5 STM1.5
PA5: length 7.6
  Bottom Layer w0.508: U3.10 STM1.10
PA6: length 7.6
  Bottom Layer w0.508: U3.11 STM1.11
PA7: length 7.6
  Bottom Layer w0.508: STM1.12 U3.12
PA8: length 7.7
  Bottom Layer w0.508: STM1.25 96.9,49.02 U2.16
PA9: length 7.7
  Bottom Layer w0.508: U2.15 96.9,51.56 STM1.26
PA10: length 7.7
  Bottom Layer w0.508: STM1.27 96.9,54.1 U2.14
PA11: length 7.7
  Bottom Layer w0.508: STM1.28 96.9,56.64 U2.13
PA12: length 7.7
  Bottom Layer w0.508: U2.12 96.9,59.18 STM1.29
PA15: length 7.7
  Bottom Layer w0.508: STM1.30 96.9,61.72 U2.11
PB3: length 7.7
  Bottom Layer w0.508: U2.10 96.9,64.26 STM1.31
PB8: length 7.7
  Top Layer w0.508: U2.5 96.9,76.96 STM1.36
PB9: length 7.7
  Top Layer w0.508: STM1.37 96.9,79.5 U2.4
PB12: length 7.7
  Bottom Layer w0.508: U2.20 96.9,38.86 STM1.21
PB13: length 7.7
  Bottom Layer w0.508: U2.19 96.9,41.4 STM1.22
PB14: length 7.7
  Bottom Layer w0.508: STM1.23 96.9,43.94 U2.18
PB15: length 7.7
  Bottom Layer w0.508: STM1.24 96.9,46.48 U2.17
PC13: length 7.6
  Bottom Layer w0.508: U3.2 STM1.2
PC14: length 7.6
  Bottom Layer w0.508: U3.3 STM1.3
PC15: length 7.6
  Bottom Layer w0.508: STM1.4 U3.4
PWM_CHARGE: length 140
  Top Layer w0.508: v1(34.1,42.74) v1(34.1,46.42)
  Bottom Layer w0.508: U2.9 96.9,66.8 STM1.32 89.34,66.87 82.23,66.87 79.69,69.41 79.69,89.6 78.17,91.12 62.04,91.12 60.77,89.85 60.77,81.72 58.99,79.95 35.75,79.95 34.1,78.3 v1(34.1,46.42) ; v1(34.1,42.74) 33.97,42.61 33.97,38.67 32.63,37.32 R26.2
PWM_CHARGE_OUT: length 33.8
  Bottom Layer w0.508: R24.1 24.77,24.08 U8.1 24.77,13.21 23.25,11.7 R2.1 11.8,11.62 6.67,11.62 5.84,12.45 Q1.1
PWM_LED: length 121.6
  Bottom Layer w0.508: R27.2 32.12,54.22 33.21,55.31 33.21,78.68 35.37,80.84 58.61,80.84 60.01,82.23 60.01,90.23 62.04,92.27 78.3,92.27 80.58,89.98 80.58,71.18 82.42,69.34 STM1.33 96.9,69.34 U2.8
PWM_LED_OUT: length 20.8
  Bottom Layer w0.508: 26.1,54.09 26.1,57.59 U9.1 25.59,58.1 22.29,58.1 20.64,59.75 20.64,70.68
S1: length 111
  Top Layer w0.508: C12.2 88.18,35.65 86.93,36.89 86.93,54.55 85.03,56.45 74.36,56.45 STM1.13
  Bottom Layer w0.508: C12.2 72.86,35.65 71.18,33.97 71.18,16.02 R20.1 69.48,14.54 57.34,14.54 56.3,13.5 SW1.2 ; U3.13 STM1.13
S2: length 96.3
  Top Layer w0.508: STM1.14 74.23,54.17 83.63,54.17 85.03,52.77 85.03,35.62 86.68,33.97 90.36,33.97 92.14,32.19 92.14,29.91 93.54,28.51 95.15,28.51 C13.2
  Bottom Layer w0.508: U3.14 STM1.14 ; SW2.2 66.7,10.48 71.69,10.48 72.33,11.11 72.33,13.65 73.23,14.56 R21.1 75.31,22.73 76.9,24.32 90.11,24.32 91.12,25.34 91.12,27.5 92.14,28.51 95.15,28.51 C13.2
S3: length 87
  Top Layer w0.508: STM1.15 74.23,51.63 83.38,51.63 84.14,50.86 84.14,35.12 86.04,33.21 89.73,33.21 91.12,31.81 91.12,22.42 92.39,21.15 95.23,21.15 C14.2
  Bottom Layer w0.508: C14.2 95.23,21.15 82.99,21.15 81.28,19.43 R22.1 81.28,13.84 80.45,13.02 75.5,13.02 74.84,12.36 SW3.2 ; U3.15 STM1.15
S4: length 76.6
  Top Layer w0.508: STM1.16 74.23,49.09 82.11,49.09 83.25,47.94 83.25,34.86 85.66,32.45 89.09,32.45 90.23,31.31 90.23,15.43 91.93,13.74 C15.2
  Bottom Layer w0.508: SW4.2 85,14.01 85.66,14.67 87.52,14.67 R23.1 88.56,13.65 95.35,13.65 C15.2 ; U3.16 STM1.16
SCL: length 67.8
  Bottom Layer w0.508: U6.3 51.12,96.08 51.12,94.3 52.39,93.03 79.95,93.03 81.6,91.38 81.6,73.22 82.93,71.88 STM1.34 96.9,71.88 U2.7
SDA: length 63.3
  Top Layer w0.508: U2.6 96.9,74.42 STM1.35
  Bottom Layer w0.508: STM1.35 82.99,74.42 82.49,74.93 82.49,92.65 80.84,94.3 54.72,94.3 53.59,95.42 U6.4
SOLAR+: length 40.8
  Top Layer w1.016: D1.1 3.57,31.35 3.57,28.64 2.6,27.67 2.6,17.34 ; Q1.2 5.65,17.34 2.6,17.34 ; 2.6,17.34 1.46,16.19 1.46,10.73 3.11,9.08 5.78,9.08 8.38,6.48 SOL.1
SOLAR-: length 79.4
  Top Layer w1.016: R2.2 11.82,24.45 7.18,24.45 5.85,23.12 Q1.3 ; R2.2 11.92,24.45 14.67,24.45 15.56,23.56 15.56,18.48 16.91,17.12 C3.1 20,8.83 SOL.2 32.13,6.48 R5.1 36.63,1.98 R9.2 ; R2.2 11.87,29.15 13.78,31.05 17.97,31.05 19.88,32.96 R4.1
$1N3294: length 10.8
  Top Layer w0.508: U4.1 43.8,27.04 42.5,25.73 R10.2
  Bottom Layer w0.508: R11.1 R10.2
$1N3303: length 36.7
  Top Layer w0.508: U4.2 46.35,15.49 45.53,14.67 40.75,14.67 R9.1
  Bottom Layer w0.508: R9.1 41.9,13.53 54.17,13.53 55.29,14.66 R11.2
$1N14439: length 14.8
  Top Layer w0.508: R18.2 49.78,34.29 48.9,33.4 48.9,32.4
  Bottom Layer w0.508: R18.2 52.83,34.29 54.03,35.48 R14.1
$1N14610: length 48
  Top Layer w0.508: 46.35,32.4 46.35,46.99 44.83,48.51 R17.1
  Bottom Layer w0.508: R16.2 57.4,48.77 56.07,50.1 42.61,50.1 41.1,48.59 R17.1
$1N14619: length 68.3
  Top Layer w0.508: 47.62,32.4 47.62,46.99 49.09,48.45 53.83,48.45 R17.2
  Bottom Layer w0.508: R17.2 45.21,48.51 43.75,47.05 43.75,27.11 42.61,25.97 38.29,25.97 37.53,25.21 R15.1
$1N14806: length 59.4
  Top Layer w0.508: v1(45.15,8.06) 48.96,8.06 49.78,8.89 R19.1 49.67,14.67 48.58,14.67 47.62,15.62 U4.3
  Bottom Layer w0.508: R8.1 33.46,19.75 31.43,17.72 31.43,9.72 33.08,8.06 v1(45.15,8.06)
$1N19814: length 5.2
  Top Layer w0.508: U7.4 24.21,91.76 C10.2
$1N19908: length 5
  Top Layer w0.508: U7.2 23.67,94.3 C10.1
$1N30770: length 15.5
  Bottom Layer w1.016: 15.81,64.33 15.81,69.79 14.73,70.87 LED.2
$1N30774: length 13.1
  Bottom Layer w1.016: 31.05,64.33 25.08,64.33 23.18,66.23 Q2.2
$1N32429: length 5.3
  Bottom Layer w0.508: R26.1 28.08,24.52 27.31,23.75 U8.2
$1N32462: length 18.2
  Top Layer w0.508: U9.2 28.19,42.04 28.82,41.42 R27.1

## Copper pours and planes (outline as drawn; the poured copper is in the pictures)
5V on Top Layer: 14.08,100 14.08,96.12 13.91,95.95 11.45,95.95 10.99,95.53 10.99,75.63 11.49,75.12 27.37,75.12 27.62,75.37 27.62,87.82 26.99,88.46 21.02,88.46 18.99,90.49 18.99,95.57 18.61,95.95 16.35,95.95 16.35,100 16.27,100
GND on Top Layer: 13.74,99.92 13.74,96.33 10.86,96.33 10.6,96.08 10.6,75.37 11.11,74.87 27.62,74.87 28,75.25 28,87.93 27.09,88.84 21.11,88.84 19.24,90.71 19.24,95.82 18.86,96.2 16.7,96.2 16.57,96.33 16.57,99.82 99.67,99.95 99.57,0.04 0,0 0,99.92
GND on Bottom Layer: 0,100 99.83,100 99.83,0 0,0

## Text on the board
Top Silkscreen Layer: G07_太阳能景观灯
